# Altium schematic sheet DDS.SchDoc (part 1 of 3)
size Letter; DrawnBy: Titan Yuan; SheetNumber: 2; SheetTotal: 8
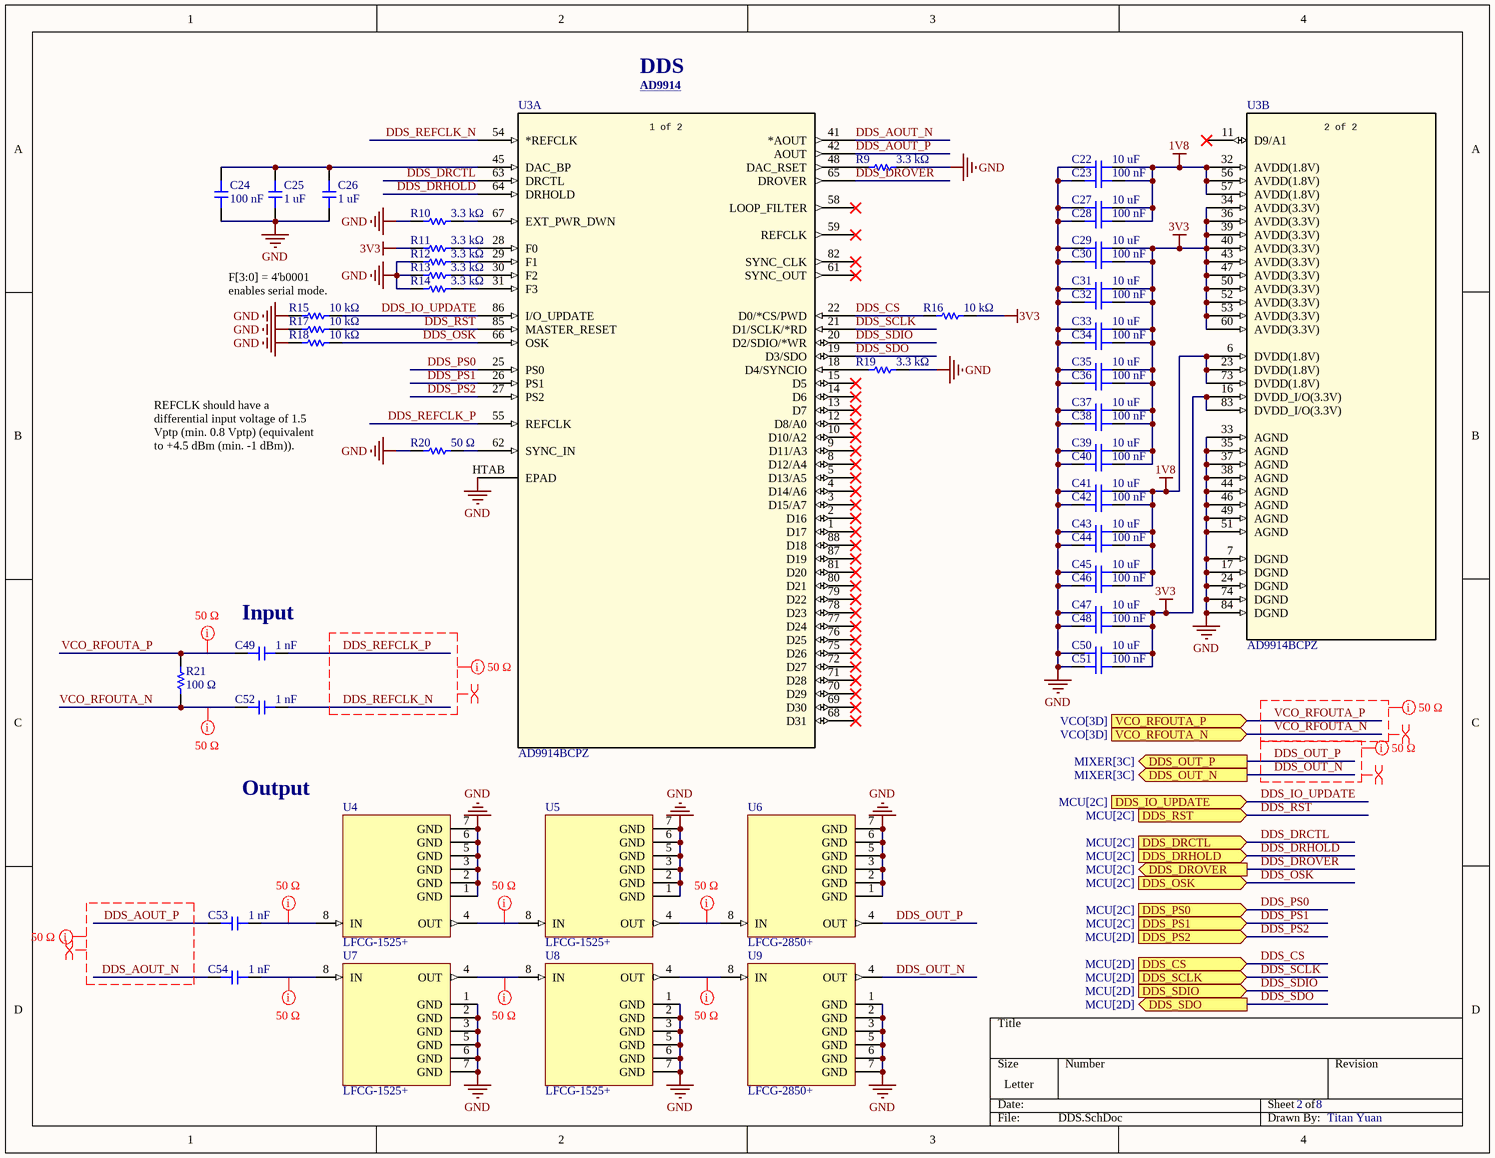
[diagram p0: DDS.SchDoc]

## Parts
C22  10 uF  [CAP_0805]
C23  100 nF  [CAP_0402]
C24  100 nF  [CAP_0402]
C25  1 uF  [CAP_0603]
C26  1 uF  [CAP_0603]
C27  10 uF  [CAP_0805]
C28  100 nF  [CAP_0402]
C29  10 uF  [CAP_0805]
C30  100 nF  [CAP_0402]
C31  10 uF  [CAP_0805]
C32  100 nF  [CAP_0402]
C33  10 uF  [CAP_0805]
C34  100 nF  [CAP_0402]
C35  10 uF  [CAP_0805]
C36  100 nF  [CAP_0402]
C37  10 uF  [CAP_0805]
C38  100 nF  [CAP_0402]
C39  10 uF  [CAP_0805]
C40  100 nF  [CAP_0402]
C41  10 uF  [CAP_0805]
C42  100 nF  [CAP_0402]
C43  10 uF  [CAP_0805]
C44  100 nF  [CAP_0402]
C45  10 uF  [CAP_0805]
C46  100 nF  [CAP_0402]
C47  10 uF  [CAP_0805]
C48  100 nF  [CAP_0402]
C49  1 nF  [CAP_0402]
C50  10 uF  [CAP_0805]
C51  100 nF  [CAP_0402]
C52  1 nF  [CAP_0402]
C53  1 nF  [CAP_0402]
C54  1 nF  [CAP_0402]
R9  3.3 kΩ  [RES_0402]
R10  3.3 kΩ  [RES_0402]
R11  3.3 kΩ  [RES_0402]
R12  3.3 kΩ  [RES_0402]
R13  3.3 kΩ  [RES_0402]
R14  3.3 kΩ  [RES_0402]
R15  10 kΩ  [RES_0402]
R16  10 kΩ  [RES_0402]
R17  10 kΩ  [RES_0402]
R18  10 kΩ  [RES_0402]
R19  3.3 kΩ  [RES_0402]
R20  50 Ω  [RES_0402]
R21  100 Ω  [RES_0402]
U3  AD9914BCPZ  [CP_88_5_ADI]  (parts A,B of 2)
U4  LFCG-1525+  [PL-429]
U5  LFCG-1525+  [PL-429]
U6  LFCG-2850+  [PL-429]
U7  LFCG-1525+  [PL-429]
U8  LFCG-1525+  [PL-429]
U9  LFCG-2850+  [PL-429]

## Ports
DDS_CS (in, see MCU[2D]), DDS_DRCTL (in, see MCU[2C]), DDS_DRHOLD (in, see MCU[2C]), DDS_DROVER (out, see MCU[2C]), DDS_IO_UPDATE (in, see MCU[2C]), DDS_OSK (in, see MCU[2C]), DDS_OUT_N (out, see MIXER[3C]), DDS_OUT_P (out, see MIXER[3C]), DDS_PS0 (in, see MCU[2C]), DDS_PS1 (in, see MCU[2C]), DDS_PS2 (in, see MCU[2D]), DDS_RST (in, see MCU[2C]), DDS_SCLK (in, see MCU[2D]), DDS_SDIO (in, see MCU[2D]), DDS_SDO (out, see MCU[2D]), VCO_RFOUTA_N (in, see VCO[3D]), VCO_RFOUTA_P (in, see VCO[3D])

## Nets
1V8: C22.2 C23.2 C27.2 C28.2 C41.2 C42.2 C43.2 C44.2 C45.2 C46.2 U3.6(DVDD(1.8V)) U3.23(DVDD(1.8V)) U3.32(AVDD(1.8V)) U3.56(AVDD(1.8V)) U3.57(AVDD(1.8V)) U3.73(DVDD(1.8V))
3V3: C29.2 C30.2 C31.2 C32.2 C33.2 C34.2 C35.2 C36.2 C37.2 C38.2 C39.2 C40.2 C47.2 C48.2 C50.2 C51.2 R11.2 R16.1 U3.16(DVDD_I/O(3.3V)) U3.34(AVDD(3.3V)) U3.36(AVDD(3.3V)) U3.39(AVDD(3.3V)) U3.40(AVDD(3.3V)) U3.43(AVDD(3.3V)) U3.47(AVDD(3.3V)) U3.50(AVDD(3.3V)) U3.52(AVDD(3.3V)) U3.53(AVDD(3.3V)) U3.60(AVDD(3.3V)) U3.83(DVDD_I/O(3.3V))
GND: C22.1 C23.1 C24.2 C25.2 C26.2 C27.1 C28.1 C29.1 C30.1 C31.1 C32.1 C33.1 C34.1 C35.1 C36.1 C37.1 C38.1 C39.1 C40.1 C41.1 C42.1 C43.1 C44.1 C45.1 C46.1 C47.1 C48.1 C50.1 C51.1 R9.1 R10.2 R12.2 R13.2 R14.2 R15.1 R17.1 R18.1 R19.1 R20.2 U3.7(DGND) U3.17(DGND) U3.24(DGND) U3.33(AGND) U3.35(AGND) U3.37(AGND) U3.38(AGND) U3.44(AGND) U3.46(AGND) U3.49(AGND) U3.51(AGND) U3.74(DGND) U3.84(DGND) U3.HTAB(EPAD) U4.1(GND) U4.2(GND) U4.3(GND) U4.5(GND) U4.6(GND) U4.7(GND) U5.1(GND) U5.2(GND) U5.3(GND) U5.5(GND) U5.6(GND) U5.7(GND) U6.1(GND) U6.2(GND) U6.3(GND) U6.5(GND) U6.6(GND) U6.7(GND) U7.1(GND) U7.2(GND) U7.3(GND) U7.5(GND) U7.6(GND) U7.7(GND) U8.1(GND) U8.2(GND) U8.3(GND) U8.5(GND) U8.6(GND) U8.7(GND) U9.1(GND) U9.2(GND) U9.3(GND) U9.5(GND) U9.6(GND) U9.7(GND)
DDS_AOUT_N: C54.2 U3.41(*AOUT)
DDS_AOUT_P: C53.2 U3.42(AOUT)
DDS_CS: R16.2 U3.22(D0/*CS/PWD) ; port DDS_CS
DDS_DRCTL: U3.63(DRCTL) ; port DDS_DRCTL
DDS_DRHOLD: U3.64(DRHOLD) ; port DDS_DRHOLD
DDS_DROVER: U3.65(DROVER) ; port DDS_DROVER
DDS_IO_UPDATE: R15.2 U3.86(I/O_UPDATE) ; port DDS_IO_UPDATE
DDS_OSK: R18.2 U3.66(OSK) ; port DDS_OSK
DDS_OUT_N: U9.4(OUT) ; port DDS_OUT_N
DDS_OUT_P: U6.4(OUT) ; port DDS_OUT_P
DDS_PS0: U3.25(PS0) ; port DDS_PS0
DDS_PS1: U3.26(PS1) ; port DDS_PS1
DDS_PS2: U3.27(PS2) ; port DDS_PS2
DDS_REFCLK_N: C52.1 U3.54(*REFCLK)
DDS_REFCLK_P: C49.1 U3.55(REFCLK)
DDS_RST: R17.2 U3.85(MASTER_RESET) ; port DDS_RST
DDS_SCLK: U3.21(D1/SCLK/*RD) ; port DDS_SCLK
DDS_SDIO: U3.20(D2/SDIO/*WR) ; port DDS_SDIO
DDS_SDO: U3.19(D3/SDO) ; port DDS_SDO
VCO_RFOUTA_N: C52.2 R21.1 ; port VCO_RFOUTA_N
VCO_RFOUTA_P: C49.2 R21.2 ; port VCO_RFOUTA_P
NetC24_1: C24.1 C25.1 C26.1 U3.45(DAC_BP)
NetC53_1: C53.1 U4.8(IN)
NetC54_1: C54.1 U7.8(IN)
NetR9_2: R9.2 U3.48(DAC_RSET)
NetR10_1: R10.1 U3.67(EXT_PWR_DWN)
NetR11_1: R11.1 U3.28(F0)
NetR12_1: R12.1 U3.29(F1)
NetR13_1: R13.1 U3.30(F2)
NetR14_1: R14.1 U3.31(F3)
NetR19_2: R19.2 U3.18(D4/SYNCIO)
NetR20_1: R20.1 U3.62(SYNC_IN)
NetU4_4: U4.4(OUT) U5.8(IN)
NetU5_4: U5.4(OUT) U6.8(IN)
NetU7_4: U7.4(OUT) U8.8(IN)
NetU8_4: U8.4(OUT) U9.8(IN)

Not connected (* = marked no-connect by the designer): U3 1(D17)* 2(D16)* 3(D15/A7)* 4(D14/A6)* 5(D13/A5)* 8(D12/A4)* 9(D11/A3)* 10(D10/A2)* 11(D9/A1)* 12(D8/A0)* 13(D7)* 14(D6)* 15(D5)* 58(LOOP_FILTER)* 59(REFCLK)* 61(SYNC_OUT)* 68(D31)* 69(D30)* 70(D29)* 71(D28)* 72(D27)* 75(D26)* 76(D25)* 77(D24)* 78(D23)* 79(D22)* 80(D21)* 81(D20)* 82(SYNC_CLK)* 87(D19)* 88(D18)*

## Layout directives
differential pair: DDS_AOUT_N, DDS_AOUT_P, DDS_OUT_N, DDS_OUT_P, DDS_REFCLK_N, DDS_REFCLK_P, VCO_RFOUTA_N, VCO_RFOUTA_P
net class 50 Ω: DDS_AOUT_N, DDS_AOUT_P, DDS_OUT_N, DDS_OUT_P, DDS_REFCLK_N, DDS_REFCLK_P, NetC53_1, NetC54_1, NetU4_4, NetU5_4, NetU7_4, NetU8_4, VCO_RFOUTA_N, VCO_RFOUTA_P

## Notes on the sheet
- DDS
- (near U3) AD9914 <https://www.analog.com/en/products/ad9914.html>
- F[3:0] = 4'b0001 enables serial mode.
- REFCLK should have a differential input voltage of 1.5 Vptp (min. 0.8 Vptp) (equivalent to +4.5 dBm (min. -1 dBm)).
- (near C49) Input
- Output
- (in symbol AD9914BCPZ, part A) 1 of 2
- (in symbol AD9914BCPZ, part B) 2 of 2